# Altium schematic sheet BLUESatPC104Template.SchDoc
size 274 x 210 mm
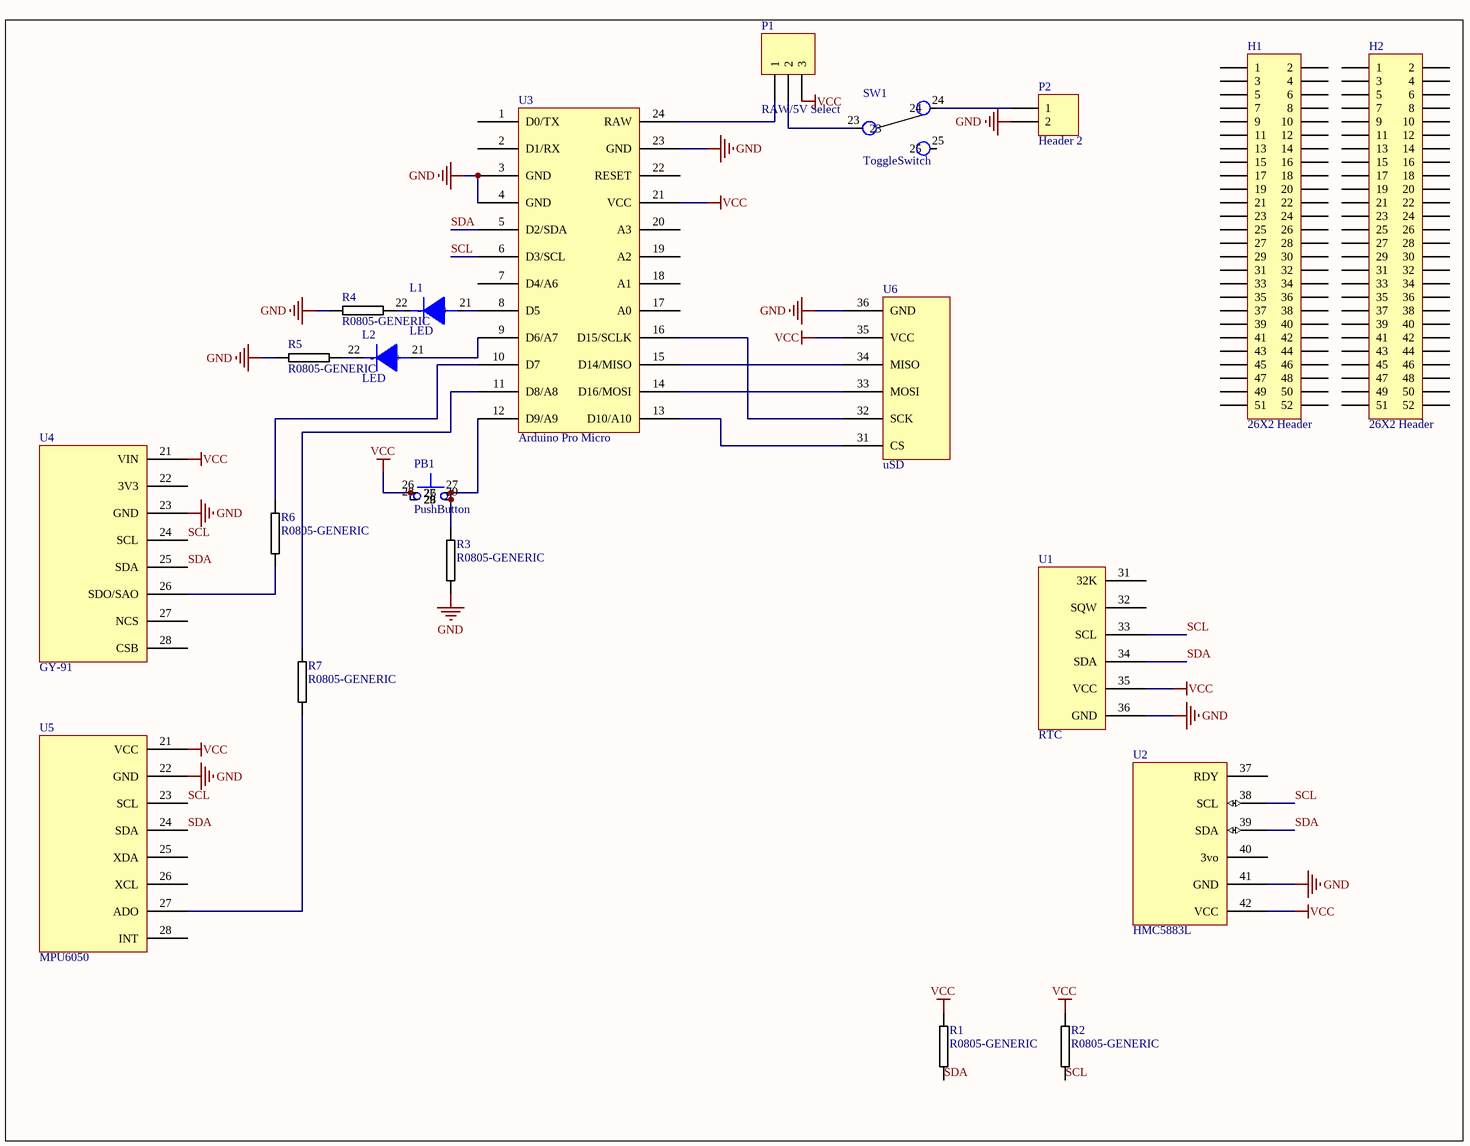
[diagram p0: BLUESatPC104Template.SchDoc]

## Parts
H1  26X2 Header  [26X2 Header]
H2  26X2 Header  [26X2 Header]
L1  LED  [LEDFOOTPRINT]
L2  LED  [LEDFOOTPRINT]
P1  RAW/5V Select  [HDR1X3]
P2  Header 2  [HDR1X2]
PB1  PushButton  [PCBComponent_1]
R1  R0805-GENERIC  [0805R-GENERIC]
R2  R0805-GENERIC  [0805R-GENERIC]
R3  R0805-GENERIC  [0805R-GENERIC]
R4  R0805-GENERIC  [0805R-GENERIC]
R5  R0805-GENERIC  [0805R-GENERIC]
R6  R0805-GENERIC  [0805R-GENERIC]
R7  R0805-GENERIC  [0805R-GENERIC]
SW1  ToggleSwitch  [SWITCHFOOTPRINT]
U1  RTC  [DS3FOOTPRINT]
U2  HMC5883L  [HMCFootprint]
U3  Arduino Pro Micro  [Arduino Pro Micro (DIP 24)]
U4  GY-91  [GYFOOTPRINT]
U5  MPU6050  [MPU6FOOTPRINT]
U6  uSD  [USDFOOTPRINT]

## Nets
GND: P2.2 R3.2 R4.2 R5.2 U1.36(GND) U2.41(GND) U3.3(GND) U3.4(GND) U3.23(GND) U4.23(GND) U5.22(GND) U6.36(GND)
VCC: P1.3 PB1.26 PB1.28 R1.1 R2.1 U1.35(VCC) U2.42(VCC) U3.21(VCC) U4.21(VIN) U5.21(VCC) U6.35(VCC)
SCL: R2.2 U1.33(SCL) U2.38(SCL) U3.6(D3/SCL) U4.24(SCL) U5.23(SCL)
SDA: R1.2 U1.34(SDA) U2.39(SDA) U3.5(D2/SDA) U4.25(SDA) U5.24(SDA)
NetL1_21: L1.21(+) U3.8(D5)
NetL1_22: L1.22(-) R4.1
NetL2_21: L2.21(+) U3.9(D6/A7)
NetL2_22: L2.22(-) R5.1
NetP1_1: P1.1 U3.24(RAW)
NetP1_2: P1.2 SW1.23
NetP2_1: P2.1 SW1.24
NetPB1_27: PB1.27 PB1.29 R3.1 U3.12(D9/A9)
NetR6_1: R6.1 U3.10(D7)
NetR6_2: R6.2 U4.26(SDO/SAO)
NetR7_1: R7.1 U3.11(D8/A8)
NetR7_2: R7.2 U5.27(ADO)
NetU3_13: U3.13(D10/A10) U6.31(CS)
NetU3_14: U3.14(D16/MOSI) U6.33(MOSI)
NetU3_15: U3.15(D14/MISO) U6.34(MISO)
NetU3_16: U3.16(D15/SCLK) U6.32(SCK)

Not connected (* = marked no-connect by the designer): H1 1 2 3 4 5 6 7 8 9 10 11 12 13 14 15 16 17 18 19 20 21 22 23 24 25 26 27 28 29 30 31 32 33 34 35 36 37 38 39 40 41 42 43 44 45 46 47 48 49 50 51 52; H2 1 2 3 4 5 6 7 8 9 10 11 12 13 14 15 16 17 18 19 20 21 22 23 24 25 26 27 28 29 30 31 32 33 34 35 36 37 38 39 40 41 42 43 44 45 46 47 48 49 50 51 52; SW1 25; U1 31(32K) 32(SQW); U2 37(RDY) 40(3vo); U3 1(D0/TX) 2(D1/RX) 7(D4/A6) 17(A0) 18(A1) 19(A2) 20(A3) 22(RESET); U4 22(3V3) 27(NCS) 28(CSB); U5 25(XDA) 26(XCL) 28(INT)

## Library data of the parts
L1 L2 = LED: pin to pad: 21>1 22>0
P1 = Header 3: Header, 3-Pin; LatestRevisionDate: 17-Jul-2002; LatestRevisionNote: Re-released for DXP Platform.; Publisher: Altium Limited
P2 = Header 2: Header, 2-Pin; LatestRevisionDate: 17-Jul-2002; LatestRevisionNote: Re-released for DXP Platform.; Publisher: Altium Limited
PB1 = PushButton: pin to pad: 26>7 27>5 28>8 29>6
R1-R7 = R0805-GENERIC: GENERIC RESISTOR 0805
SW1 = ToggleSwitch: pin to pad: 23>3 24>2 25>4
U1 = RTC: pin to pad: 31>5 32>4 33>3 34>2 35>1 36>0
U2 = HMC5883L: pin to pad: 37>0 38>1 39>2 40>3 41>4 42>5
U4 = GY-91: pin to pad: 21>7 22>6 23>5 24>4 25>3 26>2 27>1 28>0
U5 = MPU6050: pin to pad: 21>7 22>6 23>5 24>4 25>3 26>2 27>1 28>0
U6 = uSD: pin to pad: 31>5 32>4 33>3 34>2 35>1 36>0